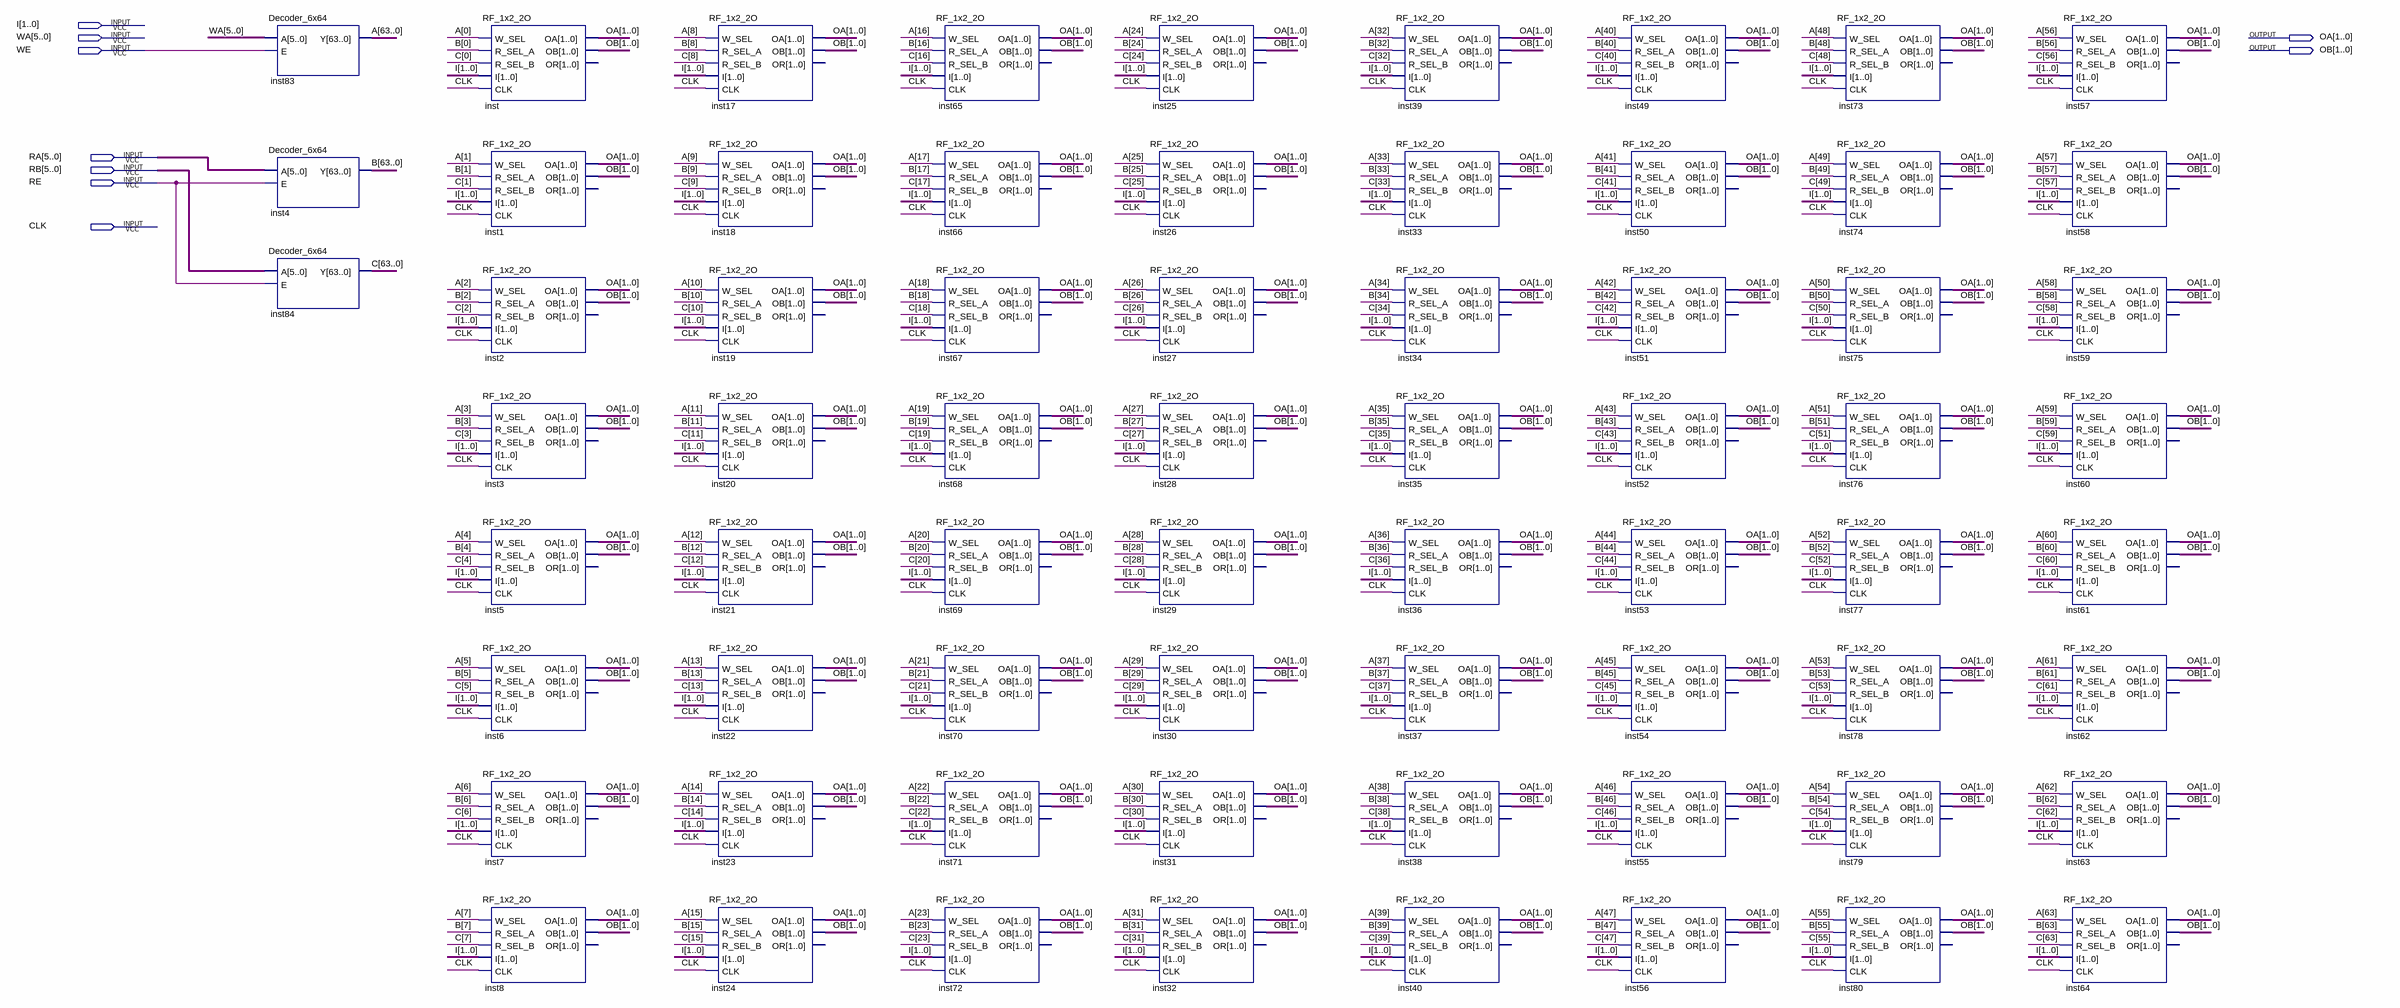
[diagram p0: schematic sheet]
// Quartus schematic RF_64x2_2O.bdf as structural Verilog: 67 symbols, 9 pins
module RF_64x2_2O (
  input  [1:0] I,
  input  [5:0] WA,
  input  WE,
  input  [5:0] RA,
  input  [5:0] RB,
  input  RE,
  input  CLK,
  output [1:0] OA,
  output [1:0] OB
);

  wire [63:0] A, B, C;

  Decoder_6x64 inst83 (.A(WA), .E(WE), .Y(A));
  Decoder_6x64 inst4 (.A(RA), .E(RE), .Y(B));
  Decoder_6x64 inst84 (.A(RB), .E(RE), .Y(C));
  RF_1x2_2O inst (.W_SEL(A[0]), .R_SEL_A(B[0]), .R_SEL_B(C[0]), .I(I), .CLK(CLK), .OA(OA), .OB(OB));  // open: OR
  RF_1x2_2O inst1 (.W_SEL(A[1]), .R_SEL_A(B[1]), .R_SEL_B(C[1]), .I(I), .CLK(CLK), .OA(OA), .OB(OB));  // open: OR
  RF_1x2_2O inst2 (.W_SEL(A[2]), .R_SEL_A(B[2]), .R_SEL_B(C[2]), .I(I), .CLK(CLK), .OA(OA), .OB(OB));  // open: OR
  RF_1x2_2O inst3 (.W_SEL(A[3]), .R_SEL_A(B[3]), .R_SEL_B(C[3]), .I(I), .CLK(CLK), .OA(OA), .OB(OB));  // open: OR
  RF_1x2_2O inst5 (.W_SEL(A[4]), .R_SEL_A(B[4]), .R_SEL_B(C[4]), .I(I), .CLK(CLK), .OA(OA), .OB(OB));  // open: OR
  RF_1x2_2O inst6 (.W_SEL(A[5]), .R_SEL_A(B[5]), .R_SEL_B(C[5]), .I(I), .CLK(CLK), .OA(OA), .OB(OB));  // open: OR
  RF_1x2_2O inst7 (.W_SEL(A[6]), .R_SEL_A(B[6]), .R_SEL_B(C[6]), .I(I), .CLK(CLK), .OA(OA), .OB(OB));  // open: OR
  RF_1x2_2O inst8 (.W_SEL(A[7]), .R_SEL_A(B[7]), .R_SEL_B(C[7]), .I(I), .CLK(CLK), .OA(OA), .OB(OB));  // open: OR
  RF_1x2_2O inst17 (.W_SEL(A[8]), .R_SEL_A(B[8]), .R_SEL_B(C[8]), .I(I), .CLK(CLK), .OA(OA), .OB(OB));  // open: OR
  RF_1x2_2O inst18 (.W_SEL(A[9]), .R_SEL_A(B[9]), .R_SEL_B(C[9]), .I(I), .CLK(CLK), .OA(OA), .OB(OB));  // open: OR
  RF_1x2_2O inst19 (.W_SEL(A[10]), .R_SEL_A(B[10]), .R_SEL_B(C[10]), .I(I), .CLK(CLK), .OA(OA), .OB(OB));  // open: OR
  RF_1x2_2O inst20 (.W_SEL(A[11]), .R_SEL_A(B[11]), .R_SEL_B(C[11]), .I(I), .CLK(CLK), .OA(OA), .OB(OB));  // open: OR
  RF_1x2_2O inst21 (.W_SEL(A[12]), .R_SEL_A(B[12]), .R_SEL_B(C[12]), .I(I), .CLK(CLK), .OA(OA), .OB(OB));  // open: OR
  RF_1x2_2O inst22 (.W_SEL(A[13]), .R_SEL_A(B[13]), .R_SEL_B(C[13]), .I(I), .CLK(CLK), .OA(OA), .OB(OB));  // open: OR
  RF_1x2_2O inst23 (.W_SEL(A[14]), .R_SEL_A(B[14]), .R_SEL_B(C[14]), .I(I), .CLK(CLK), .OA(OA), .OB(OB));  // open: OR
  RF_1x2_2O inst24 (.W_SEL(A[15]), .R_SEL_A(B[15]), .R_SEL_B(C[15]), .I(I), .CLK(CLK), .OA(OA), .OB(OB));  // open: OR
  RF_1x2_2O inst65 (.W_SEL(A[16]), .R_SEL_A(B[16]), .R_SEL_B(C[16]), .I(I), .CLK(CLK), .OA(OA), .OB(OB));  // open: OR
  RF_1x2_2O inst66 (.W_SEL(A[17]), .R_SEL_A(B[17]), .R_SEL_B(C[17]), .I(I), .CLK(CLK), .OA(OA), .OB(OB));  // open: OR
  RF_1x2_2O inst67 (.W_SEL(A[18]), .R_SEL_A(B[18]), .R_SEL_B(C[18]), .I(I), .CLK(CLK), .OA(OA), .OB(OB));  // open: OR
  RF_1x2_2O inst68 (.W_SEL(A[19]), .R_SEL_A(B[19]), .R_SEL_B(C[19]), .I(I), .CLK(CLK), .OA(OA), .OB(OB));  // open: OR
  RF_1x2_2O inst69 (.W_SEL(A[20]), .R_SEL_A(B[20]), .R_SEL_B(C[20]), .I(I), .CLK(CLK), .OA(OA), .OB(OB));  // open: OR
  RF_1x2_2O inst70 (.W_SEL(A[21]), .R_SEL_A(B[21]), .R_SEL_B(C[21]), .I(I), .CLK(CLK), .OA(OA), .OB(OB));  // open: OR
  RF_1x2_2O inst71 (.W_SEL(A[22]), .R_SEL_A(B[22]), .R_SEL_B(C[22]), .I(I), .CLK(CLK), .OA(OA), .OB(OB));  // open: OR
  RF_1x2_2O inst72 (.W_SEL(A[23]), .R_SEL_A(B[23]), .R_SEL_B(C[23]), .I(I), .CLK(CLK), .OA(OA), .OB(OB));  // open: OR
  RF_1x2_2O inst25 (.W_SEL(A[24]), .R_SEL_A(B[24]), .R_SEL_B(C[24]), .I(I), .CLK(CLK), .OA(OA), .OB(OB));  // open: OR
  RF_1x2_2O inst26 (.W_SEL(A[25]), .R_SEL_A(B[25]), .R_SEL_B(C[25]), .I(I), .CLK(CLK), .OA(OA), .OB(OB));  // open: OR
  RF_1x2_2O inst27 (.W_SEL(A[26]), .R_SEL_A(B[26]), .R_SEL_B(C[26]), .I(I), .CLK(CLK), .OA(OA), .OB(OB));  // open: OR
  RF_1x2_2O inst28 (.W_SEL(A[27]), .R_SEL_A(B[27]), .R_SEL_B(C[27]), .I(I), .CLK(CLK), .OA(OA), .OB(OB));  // open: OR
  RF_1x2_2O inst29 (.W_SEL(A[28]), .R_SEL_A(B[28]), .R_SEL_B(C[28]), .I(I), .CLK(CLK), .OA(OA), .OB(OB));  // open: OR
  RF_1x2_2O inst30 (.W_SEL(A[29]), .R_SEL_A(B[29]), .R_SEL_B(C[29]), .I(I), .CLK(CLK), .OA(OA), .OB(OB));  // open: OR
  RF_1x2_2O inst31 (.W_SEL(A[30]), .R_SEL_A(B[30]), .R_SEL_B(C[30]), .I(I), .CLK(CLK), .OA(OA), .OB(OB));  // open: OR
  RF_1x2_2O inst32 (.W_SEL(A[31]), .R_SEL_A(B[31]), .R_SEL_B(C[31]), .I(I), .CLK(CLK), .OA(OA), .OB(OB));  // open: OR
  RF_1x2_2O inst39 (.W_SEL(A[32]), .R_SEL_A(B[32]), .R_SEL_B(C[32]), .I(I), .CLK(CLK), .OA(OA), .OB(OB));  // open: OR
  RF_1x2_2O inst33 (.W_SEL(A[33]), .R_SEL_A(B[33]), .R_SEL_B(C[33]), .I(I), .CLK(CLK), .OA(OA), .OB(OB));  // open: OR
  RF_1x2_2O inst34 (.W_SEL(A[34]), .R_SEL_A(B[34]), .R_SEL_B(C[34]), .I(I), .CLK(CLK), .OA(OA), .OB(OB));  // open: OR
  RF_1x2_2O inst35 (.W_SEL(A[35]), .R_SEL_A(B[35]), .R_SEL_B(C[35]), .I(I), .CLK(CLK), .OA(OA), .OB(OB));  // open: OR
  RF_1x2_2O inst36 (.W_SEL(A[36]), .R_SEL_A(B[36]), .R_SEL_B(C[36]), .I(I), .CLK(CLK), .OA(OA), .OB(OB));  // open: OR
  RF_1x2_2O inst37 (.W_SEL(A[37]), .R_SEL_A(B[37]), .R_SEL_B(C[37]), .I(I), .CLK(CLK), .OA(OA), .OB(OB));  // open: OR
  RF_1x2_2O inst38 (.W_SEL(A[38]), .R_SEL_A(B[38]), .R_SEL_B(C[38]), .I(I), .CLK(CLK), .OA(OA), .OB(OB));  // open: OR
  RF_1x2_2O inst40 (.W_SEL(A[39]), .R_SEL_A(B[39]), .R_SEL_B(C[39]), .I(I), .CLK(CLK), .OA(OA), .OB(OB));  // open: OR
  RF_1x2_2O inst49 (.W_SEL(A[40]), .R_SEL_A(B[40]), .R_SEL_B(C[40]), .I(I), .CLK(CLK), .OA(OA), .OB(OB));  // open: OR
  RF_1x2_2O inst50 (.W_SEL(A[41]), .R_SEL_A(B[41]), .R_SEL_B(C[41]), .I(I), .CLK(CLK), .OA(OA), .OB(OB));  // open: OR
  RF_1x2_2O inst51 (.W_SEL(A[42]), .R_SEL_A(B[42]), .R_SEL_B(C[42]), .I(I), .CLK(CLK), .OA(OA), .OB(OB));  // open: OR
  RF_1x2_2O inst52 (.W_SEL(A[43]), .R_SEL_A(B[43]), .R_SEL_B(C[43]), .I(I), .CLK(CLK), .OA(OA), .OB(OB));  // open: OR
  RF_1x2_2O inst53 (.W_SEL(A[44]), .R_SEL_A(B[44]), .R_SEL_B(C[44]), .I(I), .CLK(CLK), .OA(OA), .OB(OB));  // open: OR
  RF_1x2_2O inst54 (.W_SEL(A[45]), .R_SEL_A(B[45]), .R_SEL_B(C[45]), .I(I), .CLK(CLK), .OA(OA), .OB(OB));  // open: OR
  RF_1x2_2O inst55 (.W_SEL(A[46]), .R_SEL_A(B[46]), .R_SEL_B(C[46]), .I(I), .CLK(CLK), .OA(OA), .OB(OB));  // open: OR
  RF_1x2_2O inst56 (.W_SEL(A[47]), .R_SEL_A(B[47]), .R_SEL_B(C[47]), .I(I), .CLK(CLK), .OA(OA), .OB(OB));  // open: OR
  RF_1x2_2O inst73 (.W_SEL(A[48]), .R_SEL_A(B[48]), .R_SEL_B(C[48]), .I(I), .CLK(CLK), .OA(OA), .OB(OB));  // open: OR
  RF_1x2_2O inst74 (.W_SEL(A[49]), .R_SEL_A(B[49]), .R_SEL_B(C[49]), .I(I), .CLK(CLK), .OA(OA), .OB(OB));  // open: OR
  RF_1x2_2O inst75 (.W_SEL(A[50]), .R_SEL_A(B[50]), .R_SEL_B(C[50]), .I(I), .CLK(CLK), .OA(OA), .OB(OB));  // open: OR
  RF_1x2_2O inst76 (.W_SEL(A[51]), .R_SEL_A(B[51]), .R_SEL_B(C[51]), .I(I), .CLK(CLK), .OA(OA), .OB(OB));  // open: OR
  RF_1x2_2O inst77 (.W_SEL(A[52]), .R_SEL_A(B[52]), .R_SEL_B(C[52]), .I(I), .CLK(CLK), .OA(OA), .OB(OB));  // open: OR
  RF_1x2_2O inst78 (.W_SEL(A[53]), .R_SEL_A(B[53]), .R_SEL_B(C[53]), .I(I), .CLK(CLK), .OA(OA), .OB(OB));  // open: OR
  RF_1x2_2O inst79 (.W_SEL(A[54]), .R_SEL_A(B[54]), .R_SEL_B(C[54]), .I(I), .CLK(CLK), .OA(OA), .OB(OB));  // open: OR
  RF_1x2_2O inst80 (.W_SEL(A[55]), .R_SEL_A(B[55]), .R_SEL_B(C[55]), .I(I), .CLK(CLK), .OA(OA), .OB(OB));  // open: OR
  RF_1x2_2O inst57 (.W_SEL(A[56]), .R_SEL_A(B[56]), .R_SEL_B(C[56]), .I(I), .CLK(CLK), .OA(OA), .OB(OB));  // open: OR
  RF_1x2_2O inst58 (.W_SEL(A[57]), .R_SEL_A(B[57]), .R_SEL_B(C[57]), .I(I), .CLK(CLK), .OA(OA), .OB(OB));  // open: OR
  RF_1x2_2O inst59 (.W_SEL(A[58]), .R_SEL_A(B[58]), .R_SEL_B(C[58]), .I(I), .CLK(CLK), .OA(OA), .OB(OB));  // open: OR
  RF_1x2_2O inst60 (.W_SEL(A[59]), .R_SEL_A(B[59]), .R_SEL_B(C[59]), .I(I), .CLK(CLK), .OA(OA), .OB(OB));  // open: OR
  RF_1x2_2O inst61 (.W_SEL(A[60]), .R_SEL_A(B[60]), .R_SEL_B(C[60]), .I(I), .CLK(CLK), .OA(OA), .OB(OB));  // open: OR
  RF_1x2_2O inst62 (.W_SEL(A[61]), .R_SEL_A(B[61]), .R_SEL_B(C[61]), .I(I), .CLK(CLK), .OA(OA), .OB(OB));  // open: OR
  RF_1x2_2O inst63 (.W_SEL(A[62]), .R_SEL_A(B[62]), .R_SEL_B(C[62]), .I(I), .CLK(CLK), .OA(OA), .OB(OB));  // open: OR
  RF_1x2_2O inst64 (.W_SEL(A[63]), .R_SEL_A(B[63]), .R_SEL_B(C[63]), .I(I), .CLK(CLK), .OA(OA), .OB(OB));  // open: OR
endmodule
